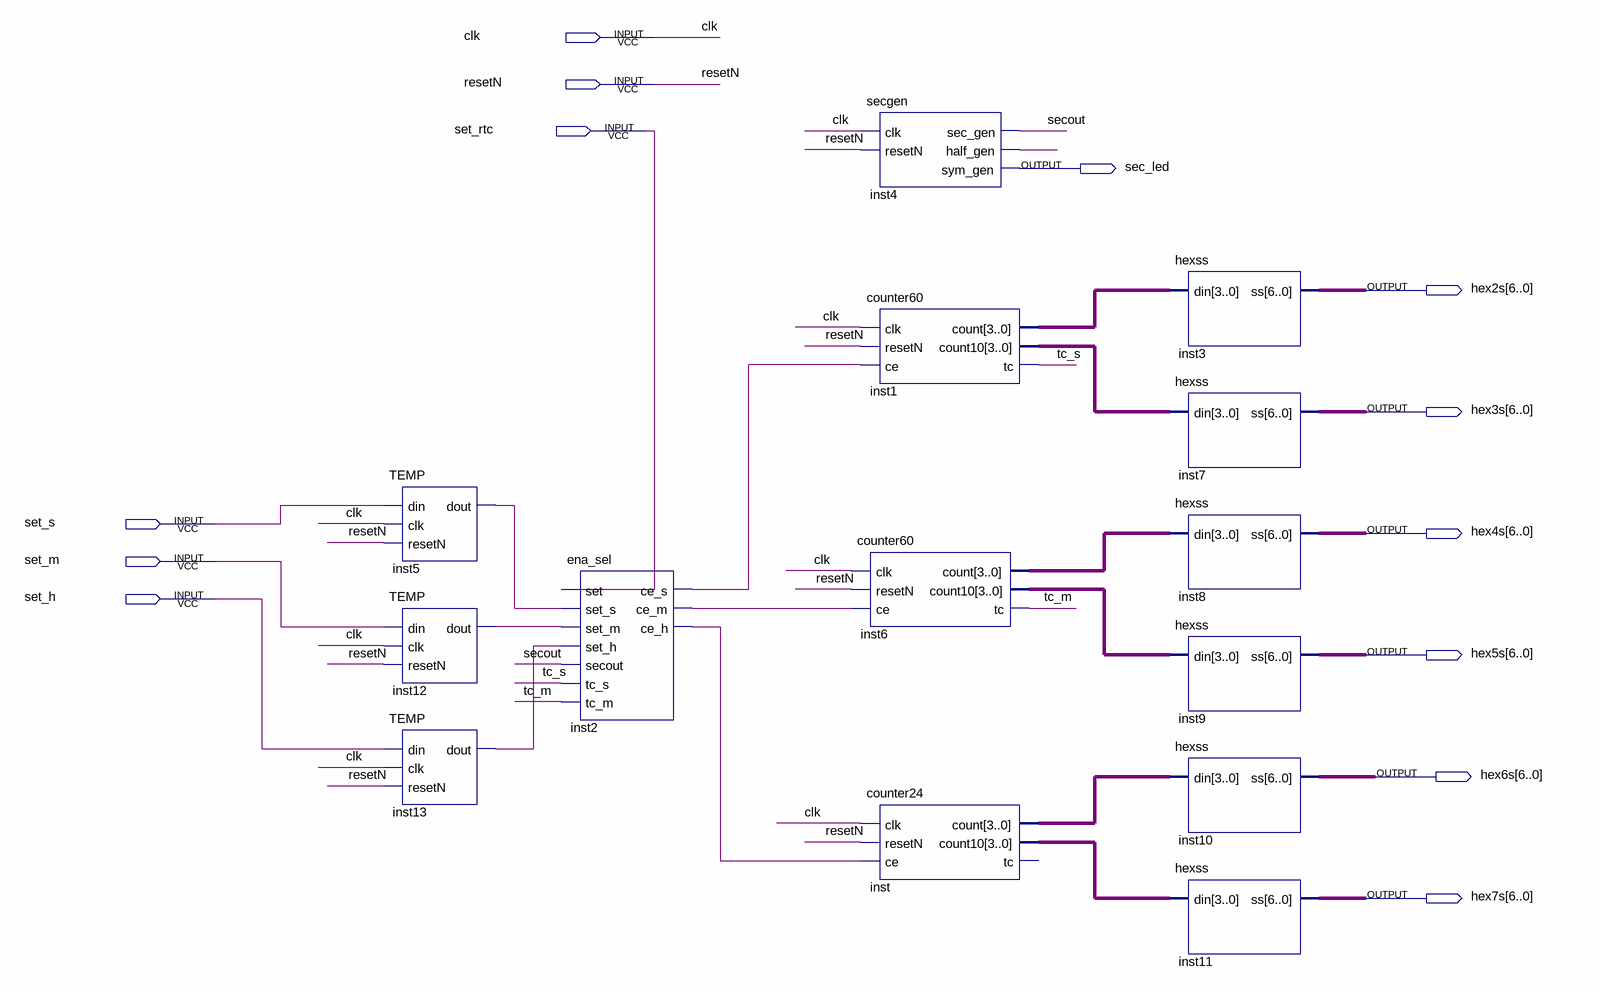
[diagram p0: schematic sheet]
// Quartus schematic test_rtc.bdf as structural Verilog: 14 symbols, 13 pins
module test_rtc (
  input  clk,
  input  resetN,
  input  set_rtc,
  input  set_s,
  input  set_m,
  input  set_h,
  output sec_led,
  output [6:0] hex2s,
  output [6:0] hex3s,
  output [6:0] hex4s,
  output [6:0] hex5s,
  output [6:0] hex6s,
  output [6:0] hex7s
);

  wire inst2_ce_h, inst2_ce_m, inst2_ce_s, inst4_half_gen, inst5_dout, inst12_dout, inst13_dout, secout,
       tc_m, tc_s;
  wire [3:0] inst1_count, inst1_count10, inst6_count, inst6_count10, inst_count, inst_count10;

  TEMP inst5 (.din(set_s), .clk(clk), .resetN(resetN), .dout(inst5_dout));
  TEMP inst12 (.din(set_m), .clk(clk), .resetN(resetN), .dout(inst12_dout));
  TEMP inst13 (.din(set_h), .clk(clk), .resetN(resetN), .dout(inst13_dout));
  ena_sel inst2 (
    .set(set_rtc), .set_s(inst5_dout), .set_m(inst12_dout), .set_h(inst13_dout), .secout(secout),
    .tc_s(tc_s), .tc_m(tc_m), .ce_s(inst2_ce_s), .ce_m(inst2_ce_m), .ce_h(inst2_ce_h));
  secgen inst4 (.clk(clk), .resetN(resetN), .sec_gen(secout), .half_gen(inst4_half_gen), .sym_gen(sec_led));
  counter60 inst1 (
    .clk(clk), .resetN(resetN), .ce(inst2_ce_s), .count(inst1_count), .count10(inst1_count10), .tc(tc_s));
  counter60 inst6 (
    .clk(clk), .resetN(resetN), .ce(inst2_ce_m), .count(inst6_count), .count10(inst6_count10), .tc(tc_m));
  counter24 inst (.clk(clk), .resetN(resetN), .ce(inst2_ce_h), .count(inst_count), .count10(inst_count10));  // open: tc
  hexss inst3 (.din(inst1_count), .ss(hex2s));
  hexss inst7 (.din(inst1_count10), .ss(hex3s));
  hexss inst8 (.din(inst6_count), .ss(hex4s));
  hexss inst9 (.din(inst6_count10), .ss(hex5s));
  hexss inst10 (.din(inst_count), .ss(hex6s));
  hexss inst11 (.din(inst_count10), .ss(hex7s));
endmodule
